# EAGLE schematic Tesseract_BO (EAGLE 7.7.0)
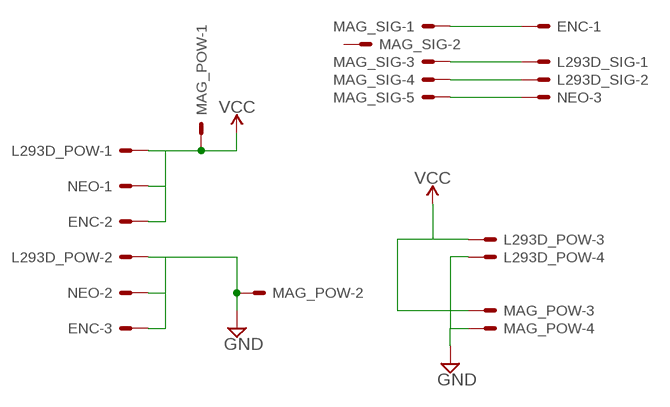
[diagram p0: schematic, sheet 1]

## Parts
ENC  JST-XH-03-PIN-LONG-PAD  [JST-XH-03-PACKAGE-LONG-PAD]
L293D_POW  JST-XH-04-PIN-LONG-PAD  [JST-XH-04-PACKAGE-LONG-PAD]
L293D_SIG  JST-XH-02-PIN-LONG-PAD  [JST-XH-02-PACKAGE-LONG-PAD]
MAG_POW  JST-XH-04-PIN-LONG-PAD  [JST-XH-04-PACKAGE-LONG-PAD]
MAG_SIG  JST-XH-05-PIN-LONG-PAD  [JST-XH-05-PACKAGE-LONG-PAD]
NEO  JST-XH-03-PIN-LONG-PAD  [JST-XH-03-PACKAGE-LONG-PAD]

## Nets
5V_GND: ENC.3 L293D_POW.2 MAG_POW.2 NEO.2 ; supply symbol labelled GND
5V_VCC: ENC.2 L293D_POW.1 MAG_POW.1 NEO.1 ; supply symbol labelled VCC
12V_GND: L293D_POW.4 MAG_POW.4 ; supply symbol labelled GND
12V_VCC: L293D_POW.3 MAG_POW.3 ; supply symbol labelled VCC
PIN3: ENC.1 MAG_SIG.1
PIN5: L293D_SIG.1 MAG_SIG.3
PIN6: L293D_SIG.2 MAG_SIG.4
PIN7: MAG_SIG.5 NEO.3
Unconnected: MAG_SIG.2

## Library data of the parts
ENC NEO = Rembrandt Electronics - JST XH Connectors v1-0:JST-XH-03-PIN: JST XH Connector 2 Pin Wire to board connector. Pitch: 2,54 mm, (0.100") Number of pins: 3 Created by Rembrandt Electronics www.rembrandtelectronics.com
L293D_POW MAG_POW = Rembrandt Electronics - JST XH Connectors v1-0:JST-XH-04-PIN: JST XH Connector 2 Pin Wire to board connector. Pitch: 2,54 mm, (0.100") Number of pins: 4 Created by Rembrandt Electronics www.rembrandtelectronics.com
L293D_SIG = Rembrandt Electronics - JST XH Connectors v1-0:JST-XH-02-PIN: JST XH Connector 2 Pin Wire to board connector. Pitch: 2,54 mm, (0.100") Number of pins: 2 Created by Rembrandt Electronics www.rembrandtelectronics.com
MAG_SIG = Rembrandt Electronics - JST XH Connectors v1-0:JST-XH-05-PIN: JST XH Connector 2 Pin Wire to board connector. Pitch: 2,54 mm, (0.100") Number of pins: 5 Created by Rembrandt Electronics www.rembrandtelectronics.com